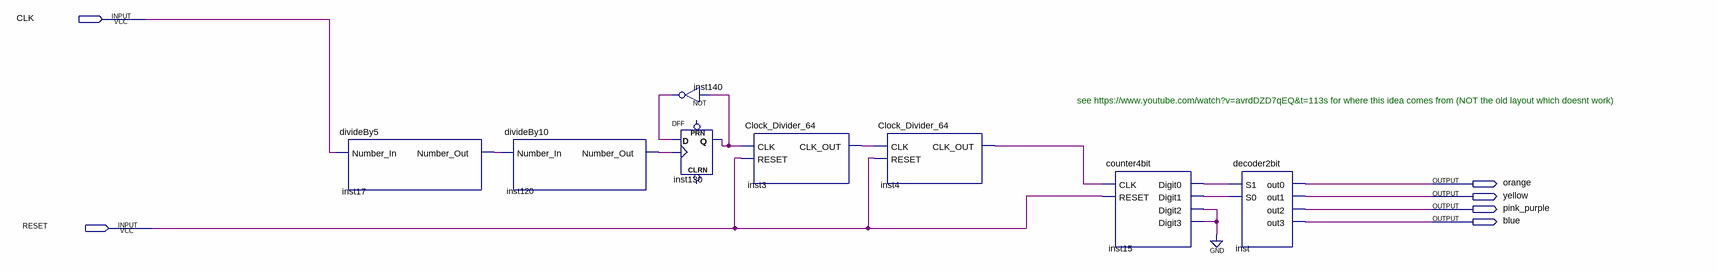
[diagram p0: schematic sheet]
// Quartus schematic stepper_motor_forwards.bdf as structural Verilog: 8 symbols, 6 pins
module stepper_motor_forwards (
  input  CLK,
  input  RESET,
  output orange,
  output yellow,
  output pink_purple,
  output blue
);

  wire inst3_clk_out, inst4_clk_out, inst15_digit0, inst15_digit1, inst15_digit2, inst17_number_out,
       inst120_number_out, inst130_q, inst140_out;

  divideBy5 inst17 (.Number_In(CLK), .Number_Out(inst17_number_out));
  divideBy10 inst120 (.Number_In(inst17_number_out), .Number_Out(inst120_number_out));
  not inst140 (inst140_out, inst130_q);
  DFF inst130 (.CLK(inst120_number_out), .D(inst140_out), .Q(inst130_q));  // open: CLRN, PRN
  Clock_Divider_64 inst3 (.CLK(inst130_q), .RESET(RESET), .CLK_OUT(inst3_clk_out));
  Clock_Divider_64 inst4 (.CLK(inst3_clk_out), .RESET(RESET), .CLK_OUT(inst4_clk_out));
  counter4bit inst15 (
    .CLK(inst4_clk_out), .RESET(RESET), .Digit0(inst15_digit0), .Digit1(inst15_digit1),
    .Digit2(inst15_digit2), .Digit3(inst15_digit2));
  decoder2bit inst (
    .S1(inst15_digit0), .S0(inst15_digit1), .out0(orange), .out1(yellow), .out2(pink_purple), .out3(blue));
  // also tied to GND on the sheet: inst15_digit2

  // Notes on the sheet:
  //   see https://www.youtube.com/watch?v=avrdDZD7qEQ&t=113s for where this idea comes from (NOT the old layout which doesnt work)
endmodule
